# EAGLE design MainTestBRD (EAGLE 7.1.0)
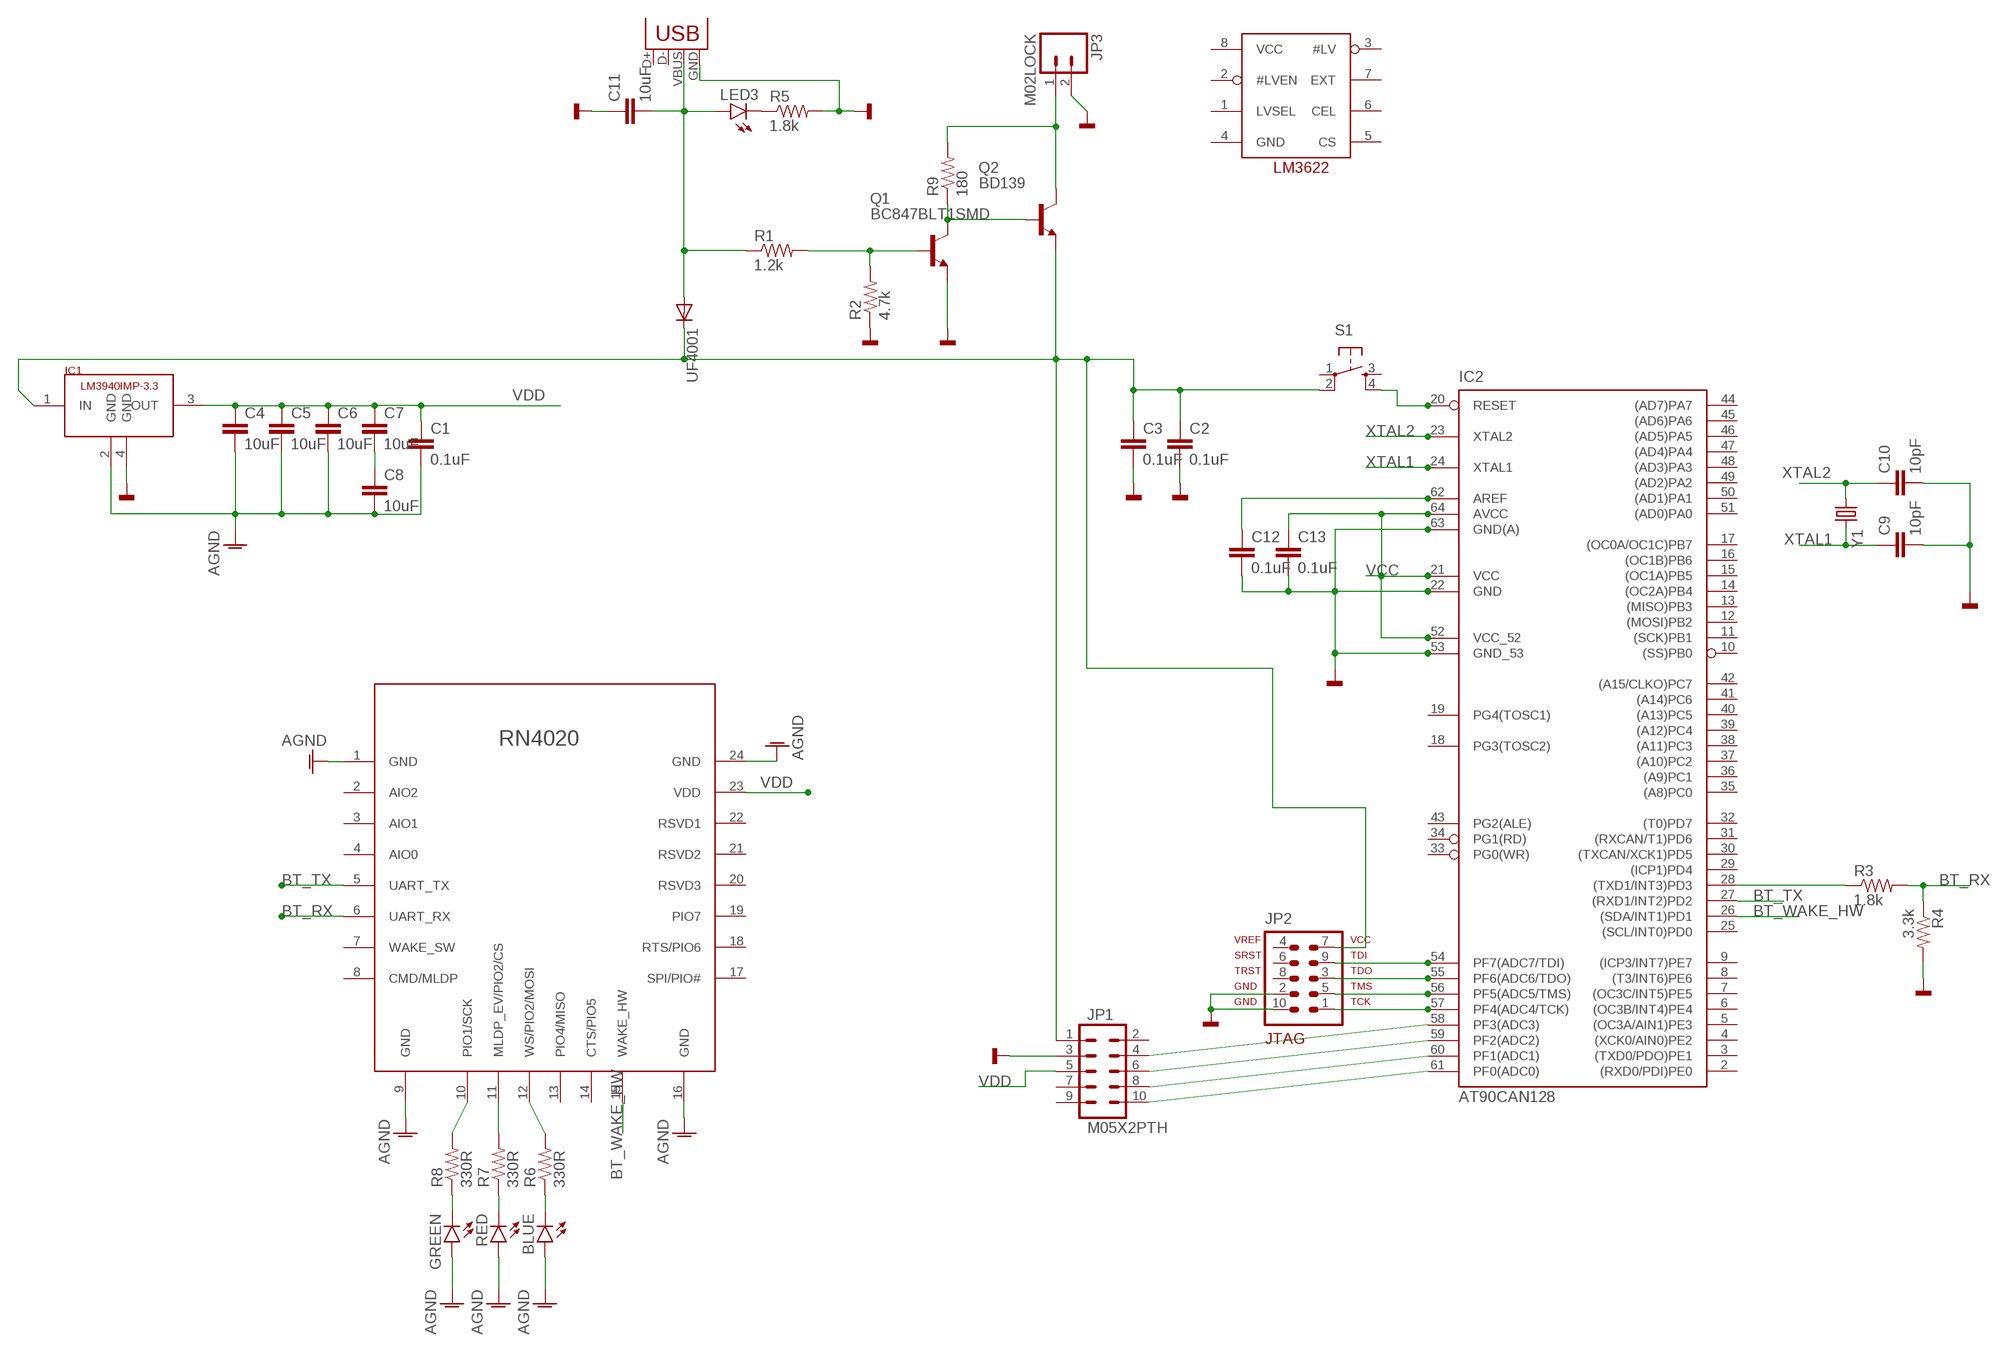
[diagram p0: schematic, sheet 1]

## Parts
BLUE  LED1206  [LED-1206]
C1  0.1uF  10UF-6.3V-20%(1206)  [1206]
C2  0.1uF  10UF-6.3V-20%(1206)  [1206]
C3  0.1uF  10UF-6.3V-20%(1206)  [1206]
C4  10uF  10UF-6.3V-20%(1206)  [1206]
C5  10uF  10UF-6.3V-20%(1206)  [1206]
C6  10uF  10UF-6.3V-20%(1206)  [1206]
C7  10uF  10UF-6.3V-20%(1206)  [1206]
C8  10uF  10UF-6.3V-20%(1206)  [1206]
C9  10pF  10UF-6.3V-20%(1206)  [1206]
C10  10pF  10UF-6.3V-20%(1206)  [1206]
C11  10uF  10UF-6.3V-20%(1206)  [1206]
C12  0.1uF  10UF-6.3V-20%(1206)  [1206]
C13  0.1uF  10UF-6.3V-20%(1206)  [1206]
GREEN  LED1206  [LED-1206]
IC1  LM3940IMP-3.3  [SOT223]
IC2  AT90CAN128  [TQFP64]
JP1  M05X2PTH  [AVR_ICSP]
JP2  AVR-JTAG-10  [AVR-JTAG-10]
JP3  M02LOCK  [1X02_LOCK]
JP4  USB-B  USBPTH  [USB-B-PTH]
LED3  LED1206  [LED-1206]
Q1  BC847BLT1SMD  [SOT23]
Q2  BD139  [TO126]
R1  1.2k  1.8KOHM1/10W1%(0603)  [0603-RES]
R2  4.7k  1.8KOHM1/10W1%(0603)  [0603-RES]
R3  1.8k  3.3KOHM1/10W1%(0603)  [0603-RES]
R4  3.3k  3.3KOHM1/10W1%(0603)  [0603-RES]
R5  1.8k  1.8KOHM1/10W1%(0603)  [0603-RES]
R6  330R  1.8KOHM1/10W1%(0603)  [0603-RES]
R7  330R  1.8KOHM1/10W1%(0603)  [0603-RES]
R8  330R  1.8KOHM1/10W1%(0603)  [0603-RES]
R9  180  1.8KOHM1/10W1%(0603)  [0603-RES]
RED  LED1206  [LED-1206]
S1  TAC_SWITCHPTH  [TACTILE-PTH]
U$1  LM3622  [SO08]
U$2  RN4020  [RN4020]
UF4001  DIODE-DO41-7.6  [DO41-7.6]
Y1  CRYSTALHC49UV  [HC49U-V]

## Nets
AGND: BLUE.A C1.2 C4.2 C5.2 C6.2 C8.2 GREEN.A IC1.2(GND) RED.A U$2.1(GND) U$2.9(GND) U$2.16(GND) U$2.24(GND)
BT_RX: R3.2 R4.1 U$2.6(UART_RX)
BT_TX: IC2.27((RXD1/INT2)PD2) U$2.5(UART_TX)
BT_WAKE_HW: IC2.26((SDA/INT1)PD1) U$2.15(WAKE_HW)
GND: C2.2 C3.2 C9.2 C10.2 C11.1 C12.2 C13.2 IC1.4(GND) IC2.22(GND) IC2.53(GND_53) IC2.63(GND(A)) JP1.3 JP2.2 JP2.10 JP3.2 JP4.GND Q1.2(E) R2.1 R4.2 R5.2
N$1: R6.2 U$2.12(WS/PIO2/MOSI)
N$2: R8.2 U$2.10(PIO1/SCK)
N$3: IC2.28((TXD1/INT3)PD3) R3.1
N$4: BLUE.C R6.1
N$5: R7.2 U$2.11(MLDP_EV/PIO2/CS)
N$6: IC2.57(PF4(ADC4/TCK)) JP2.1
N$7: R7.1 RED.C
N$8: C7.2 C8.1
N$9: IC2.56(PF5(ADC5/TMS)) JP2.5
N$10: GREEN.C R8.1
N$11: IC2.55(PF6(ADC6/TDO)) JP2.3
N$12: IC2.54(PF7(ADC7/TDI)) JP2.9
N$13: IC2.20(RESET) S1.4
N$14: Q1.1(B) R1.2 R2.2
N$15: C12.1 IC2.62(AREF)
N$16: IC2.61(PF0(ADC0)) JP1.10
N$17: C11.2 JP4.VBUS LED3.A R1.1 UF4001.A
N$18: Q1.3(C) Q2.3(B) R9.1
N$19: IC2.60(PF1(ADC1)) JP1.8
N$20: LED3.C R5.1
N$21: IC2.59(PF2(ADC2)) JP1.6
N$22: IC2.58(PF3(ADC3)) JP1.4
N$30: JP3.1 Q2.2(C) R9.2
N$31: Q2.1(E)
VCC: C2.1 C3.1 C13.1 IC1.1(IN) IC2.21(VCC) IC2.52(VCC_52) IC2.64(AVCC) JP1.1 JP2.7 S1.2 UF4001.C
VDD: C1.1 C4.1 C5.1 C6.1 C7.1 IC1.3(OUT) JP1.5 U$2.23(VDD)
XTAL1: C9.1 IC2.24(XTAL1) Y1.2
XTAL2: C10.1 IC2.23(XTAL2) Y1.1
Unconnected: IC2.2((RXD0/PDI)PE0) IC2.3((TXD0/PDO)PE1) IC2.4((XCK0/AIN0)PE2) IC2.5((OC3A/AIN1)PE3) IC2.6((OC3B/INT4)PE4) IC2.7((OC3C/INT5)PE5) IC2.8((T3/INT6)PE6) IC2.9((ICP3/INT7)PE7) IC2.10((SS)PB0) IC2.11((SCK)PB1) IC2.12((MOSI)PB2) IC2.13((MISO)PB3) IC2.14((OC2A)PB4) IC2.15((OC1A)PB5) IC2.16((OC1B)PB6) IC2.17((OC0A/OC1C)PB7) IC2.18(PG3(TOSC2)) IC2.19(PG4(TOSC1)) IC2.25((SCL/INT0)PD0) IC2.29((ICP1)PD4) IC2.30((TXCAN/XCK1)PD5) IC2.31((RXCAN/T1)PD6) IC2.32((T0)PD7) IC2.33(PG0(WR)) IC2.34(PG1(RD)) IC2.35((A8)PC0) IC2.36((A9)PC1) IC2.37((A10)PC2) IC2.38((A11)PC3) IC2.39((A12)PC4) IC2.40((A13)PC5) IC2.41((A14)PC6) IC2.42((A15/CLKO)PC7) IC2.43(PG2(ALE)) IC2.44((AD7)PA7) IC2.45((AD6)PA6) IC2.46((AD5)PA5) IC2.47((AD4)PA4) IC2.48((AD3)PA3) IC2.49((AD2)PA2) IC2.50((AD1)PA1) IC2.51((AD0)PA0) JP1.2 JP1.7 JP1.9 JP2.4 JP2.6 JP2.8 JP4.D+ JP4.D- S1.1 S1.3 U$1.1(LVSEL) U$1.2(#LVEN) U$1.3(#LV) U$1.4(GND) U$1.5(CS) U$1.6(CEL) U$1.7(EXT) U$1.8(VCC) U$2.2(AIO2) U$2.3(AIO1) U$2.4(AIO0) U$2.7(WAKE_SW) U$2.8(CMD/MLDP) U$2.13(PIO4/MISO) U$2.14(CTS/PIO5) U$2.17(SPI/PIO#) U$2.18(RTS/PIO6) U$2.19(PIO7) U$2.20(RSVD3) U$2.21(RSVD2) U$2.22(RSVD1)

## Library data of the parts
BLUE GREEN LED3 RED = SparkFun-LED:LED: LEDs Standard schematic elements and footprints for 5mm, 3mm, 1206, and 0603 sized LEDs. 5mm - Spark Fun Electronics SKU : COM-00529 (and others)
C1-C3 C9 C10 C12 C13 = SparkFun-Capacitors:10UF-6.3V-20%(1206): CAP-10057 Ceramic; PROD_ID: CAP-10057; VALUE: 10uF
C4-C8 C11 = SparkFun-Capacitors:10UF-6.3V-20%(1206): CAP-10057 Ceramic; PROD_ID: CAP-10057
IC1 = mylib:LM3940IMP-3.3: 1A Low Dropout Regulator for 5V to 3.3V conversion
IC2 = at90can128:AT90CAN128
JP1 = SparkFun-Connectors:M05X2: Header 5x2 Standard 10-pin dual row 0.1" header. Commonly used with AVR-ISP. Use with Spark Fun Electronics SKU: PRT-00778
JP2 = atmel:AVR-JTAG-10: AVR JTAG Debug/Programming Header
JP3 = SparkFun-Connectors:M02: Standard 2-pin 0.1" header. Use with - straight break away headers ( PRT-00116) - right angle break away headers (PRT-00553) - swiss pins (PRT-00743) - machine pins (PRT-00117) - female headers (PRT-00115) Molex polarized connector foot print use with: PRT-08233 with associated crimp pins and housings. 2.54_SCREWTERM for use with PRT-10571. 3.5mm Screw Terminal footprints for PRT-08084 5mm Screw Terminal footprints for use with PRT-08432
JP4 = SparkFun-Connectors:USB: USB Connectors USB-B-PTH is fully proven SKU : PRT-00139/CONN-08278 USB-miniB is fully proven SKU : PRT-00587 USB-A-PCB is untested. USB-A-H is throughly reviewed, but untested. Spark Fun Electronics SKU : PRT-00437 USB-B-SMT is throughly reviewed, but untested. Needs silkscreen touching up. USB-A-S has not been used/tested USB-MB-H has not been used/tested USB-MICROB has been used. CONN-09505; PROD_ID: CONN-08278
Q1 = transistor-npn:BC847*: NPN Transistor
Q2 = transistor-npn:BD139*: NPN Transistor
R1 R2 R6-R9 = SparkFun-Resistors:1.8KOHM1/10W1%(0603): RES-09119; PROD_ID: RES-09119; VALUE: 1.8k
R3 R4 = SparkFun-Resistors:3.3KOHM1/10W1%(0603): RES-07851; PROD_ID: RES-07851
R5 = SparkFun-Resistors:1.8KOHM1/10W1%(0603): RES-09119; PROD_ID: RES-09119
S1 = SparkFun-Electromechanical:TAC_SWITCH: Momentary Switch Button commonly used for reset or general input. Spark Fun Electronics SKU : COM-00097 SMT- SWCH-08247
U$1 = adafruit:LM3622: National LM3622 li-ion charger http://www.ladyada.net/library/eagle
U$2 = microchip:RN4020
UF4001 = diode:DIODE-: DIODE
Y1 = SparkFun-FreqCtrl:CRYSTAL: Various standard crystals. Proven footprints. Spark Fun Electronics SKU : COM-00534

## Board
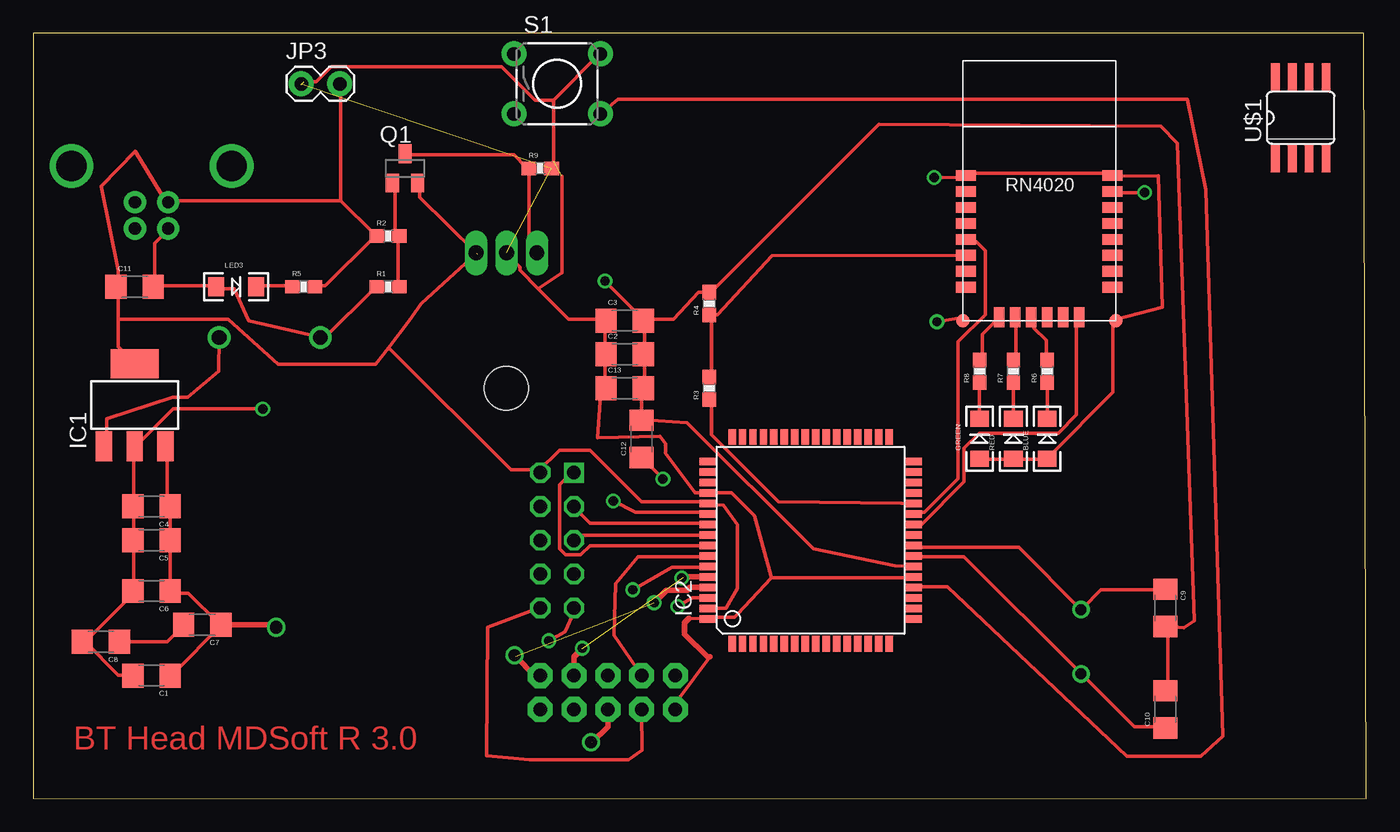
[diagram p1: board, top side]
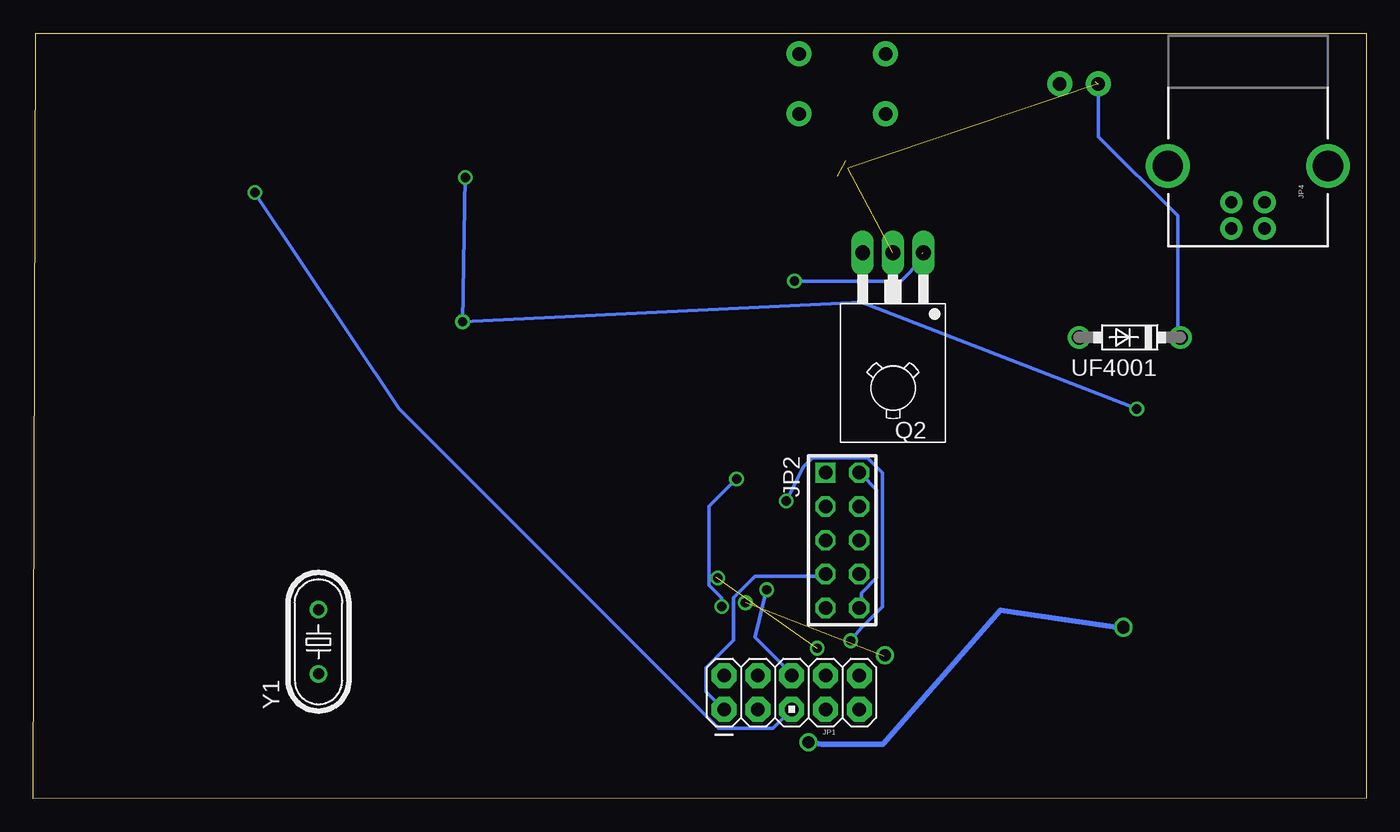
[diagram p2: board, bottom side, seen from below]

Size 100.18 x 57.5 mm. Coordinates in mm from the lower left corner, seen from the top.
Outline: 0,0.01 100.18,0 100,57.5 0,57.5 0,0.01
Copper layers (1*16): Top 0.035mm / dielectric 1.5mm / Bottom 0.035mm
Design rules "default *": minimum track width 10mil, minimum drill 0.7mm, track to track 8mil, track to pad 8mil, pad to pad 8mil, via to via 8mil, smd to smd 8mil, copper to edge 40mil, drill to drill 8mil, minimum pad ring 10mil, minimum via ring 8mil, stop-mask expansion 4mil, vias tented up to drill 0mil, thermal gap 10mil

### Footprints (pad centres in the part's own frame; a part is rotated, then mirrored left to right if it is on the bottom)
LED-1206 = smd 1.2 x 1.4: A -1.5,0; C 1.5,0
1206 = smd 1.6 x 1.8: 1 -1.4,0; 2 1.4,0
SOT223 = smd 1.219 x 2.235: 1 1.499,0.711; 2 3.81,0.711; 3 6.121,0.711 | smd 3.6 x 2.2: 4 3.81,6.909
TQFP64 = smd 1.194 x 0.559: 1 -7.76,5.905; 2 -7.76,5.118; 3 -7.76,4.331; 4 -7.76,3.543; 5 -7.76,2.756; 6 -7.76,1.968; 7 -7.76,1.181; 8 -7.76,0.394; 9 -7.76,-0.394; 10 -7.76,-1.181; 11 -7.76,-1.968; 12 -7.76,-2.756; 13 -7.76,-3.543; 14 -7.76,-4.331; 15 -7.76,-5.118; 16 -7.76,-5.905; 33 7.76,-5.905; 34 7.76,-5.118; 35 7.76,-4.331; 36 7.76,-3.543; 37 7.76,-2.756; 38 7.76,-1.968; 39 7.76,-1.181; 40 7.76,-0.394; 41 7.76,0.394; 42 7.76,1.181; 43 7.76,1.968; 44 7.76,2.756; 45 7.76,3.543; 46 7.76,4.331; 47 7.76,5.118; 48 7.76,5.905 | smd 0.559 x 1.194: 17 -5.905,-7.76; 18 -5.118,-7.76; 19 -4.331,-7.76; 20 -3.543,-7.76; 21 -2.756,-7.76; 22 -1.968,-7.76; 23 -1.181,-7.76; 24 -0.394,-7.76; 25 0.394,-7.76; 26 1.181,-7.76; 27 1.968,-7.76; 28 2.756,-7.76; 29 3.543,-7.76; 30 4.331,-7.76; 31 5.118,-7.76; 32 5.905,-7.76; 49 5.905,7.76; 50 5.118,7.76; 51 4.331,7.76; 52 3.543,7.76; 53 2.756,7.76; 54 1.968,7.76; 55 1.181,7.76; 56 0.394,7.76; 57 -0.394,7.76; 58 -1.181,7.76; 59 -1.968,7.76; 60 -2.756,7.76; 61 -3.543,7.76; 62 -4.331,7.76; 63 -5.118,7.76; 64 -5.905,7.76
AVR_ICSP = drill 1.016 pad 1.88 octagon: 1 -1.27,5.08; 2 1.27,5.08; 3 -1.27,2.54; 4 1.27,2.54; 5 -1.27,0; 6 1.27,0; 7 -1.27,-2.54; 8 1.27,-2.54; 9 -1.27,-5.08; 10 1.27,-5.08
AVR-JTAG-10 = drill 1.016 square: 1 -5.08,-1.27 | drill 1.016 octagon: 2 -5.08,1.27; 3 -2.54,-1.27; 4 -2.54,1.27; 5 0,-1.27; 6 0,1.27; 7 2.54,-1.27; 8 2.54,1.27; 9 5.08,-1.27; 10 5.08,1.27
1X02_LOCK = drill 1.016 pad 1.88: 1 -0.178,0; 2 2.718,0
USB-B-PTH = drill 0.914 pad 1.676: D+ 0,1.25; D- 1.981,1.25; GND 0,-1.25; VBUS 1.981,-1.25 | drill 2.286: S1 -2.718,-6.02; S2 -2.718,6.02
SOT23 = smd 1 x 1.4: 1 -0.95,-1.1; 2 0.95,-1.1; 3 0,1.1
TO126 = drill 1.118 long: 1 -2.286,-5.08; 2 0,-5.08; 3 2.286,-5.08 | hole 3.302: 0,5.08
0603-RES = smd 1.1 x 1: 1 -0.85,0; 2 0.85,0
TACTILE-PTH = drill 1.016 pad 1.88: 1 -3.251,2.261; 2 3.251,2.261; 3 -3.251,-2.261; 4 3.251,-2.261
SO08 = smd 0.66 x 2.032: 1 -1.905,-3.073; 2 -0.635,-3.073; 3 0.635,-3.073; 4 1.905,-3.073; 5 1.905,3.073; 6 0.635,3.073; 7 -0.635,3.073; 8 -1.905,3.073
RN4020 = smd 1.5 x 0.8: 1 0.25,10.9; 2 0.25,9.7; 3 0.25,8.5; 4 0.25,7.3; 5 0.25,6.1; 6 0.25,4.9; 7 0.25,3.7; 8 0.25,2.5; 17 11.25,2.5; 18 11.25,3.7; 19 11.25,4.9; 20 11.25,6.1; 21 11.25,7.3; 22 11.25,8.5; 23 11.25,9.7; 24 11.25,10.9 | smd 1 x 1: 9 0,0; 16 11.5,0 | smd 0.8 x 1.5: 10 2.75,0.25; 11 3.95,0.25; 12 5.15,0.25; 13 6.35,0.25; 14 7.55,0.25; 15 8.75,0.25
DO41-7.6 = drill 1.1 pad 1.7: A 3.81,0; C -3.81,0
HC49U-V = drill 0.813: 1 -2.413,0; 2 2.413,0

### Placement (x,y rotation side)
BLUE  76.2,27.03 90 top
C1  8.89,9.25 180 top
C2  44.45,33.38 0 top
C3  44.45,35.92 0 top
C4  8.89,21.95 180 top
C5  8.89,19.41 180 top
C6  8.89,15.6 180 top
C7  12.7,13.06 180 top
C8  5.08,11.79 180 top
C9  85.09,14.33 270 top
C10  85.09,6.71 90 top
C11  7.62,38.46 0 top
C12  45.72,27.03 90 top
C13  44.45,30.84 0 top
GREEN  71.12,27.03 90 top
IC1  3.81,25.76 0 top
IC2  58.42,19.41 90 top
JP1  43.18,7.98 90 bottom
JP2  39.37,19.41 270 bottom
JP3  20.32,53.7 0 top
JP4  8.89,44.81 270 bottom
LED3  15.24,38.46 0 top
Q1  27.94,47.35 0 top
Q2  35.56,35.92 180 bottom
R1  26.67,38.46 0 top
R2  26.67,42.27 0 top
R3  50.8,30.84 90 top
R4  50.8,37.19 90 top
R5  20.32,38.46 0 top
R6  76.2,32.11 90 top
R7  73.66,32.11 90 top
R8  71.12,32.11 90 top
R9  38.1,47.35 0 top
RED  73.66,27.03 90 top
S1  39.37,53.7 0 top
U$1  95.25,51.16 0 top
U$2  69.85,35.92 0 top
UF4001  17.78,34.65 180 bottom
Y1  78.74,11.79 90 bottom

### Tracks (layer width: path | path; a pad name or v marks a point on that pad's centre or on a via)
AGND  (via drill 0.7)
  Top 0.254: GREEN.A 71.32,25.5 73.61,25.5 RED.A 73.84,25.5 76.12,25.5 BLUE.A 76.35,25.73 81.15,30.53 81.15,35.79 U$2.16 81.38,36.02 84.84,36.93 84.56,46.79 81.61,46.76 81.15,46.76 U$2.24 80.92,46.99 70.18,46.99 U$2.1 69.95,46.65 69.49,46.65 v67.71,46.67 | 3.89,11.79 6.4,9.27 7.32,9.27 C1.2 | 3.89,11.79 7.54,15.44 C6.2 7.54,15.67 7.54,19.33 C5.2 7.54,19.56 7.54,21.84 C4.2 7.54,21.96 7.54,26.3 IC1.2 7.77,26.53 10.52,29.28 v17.25,29.28 | 3.89,11.79 C8.2 | v67.91,35.83 69.72,36.13 U$2.9
  Bottom 0.254: v67.71,46.67 v67.91,35.83 37.95,37.28 v17.25,29.28
BT_RX
  Top 0.254: R3.2 50.98,31.9 50.98,36.25 R4.1 51.44,36.35 55.52,40.79 69.88,40.82 U$2.6
BT_TX
  Top 0.254: IC2.27 66.29,21.5 66.98,21.5 69.49,24.02 69.49,34.31 71.55,36.36 71.55,41.16 70.87,41.85 70.18,41.85 U$2.5
BT_WAKE_HW
  Top 0.254: IC2.26 66.29,20.59 66.75,20.59 69.95,23.79 69.95,26.3 71.09,27.45 77.04,27.45 78.41,28.82 78.41,36.13 U$2.15
GND  (via drill 0.7)  (1 unrouted)
  Top 0.254: R5.2 21.26,38.53 21.95,38.53 25.6,42.19 R2.1 25.6,42.42 23.09,44.93 | 23.09,44.93 23.09,53.62 JP3.2 | 33.15,41.05 33.3,40.97 | 33.3,40.97 29.03,45.16 29.03,46.08 Q1.2 | 6.4,36.02 6.4,33.96 7.54,32.82 IC1.4 | 6.4,36.02 6.4,38.3 C11.1 6.4,38.53 6.4,39.67 5.11,46 7.64,48.64 10.06,44.7 JP4.GND 10.29,44.93 23.09,44.93 | 33.3,40.97 29.16,37.16 28.25,35.89 26.7,33.89 | 26.7,33.89 25.73,32.64 18.39,32.61 14.63,36.02 6.4,36.02 | C10.2 85.27,8.13 85.27,12.7 C9.2 85.27,12.93 86.49,12.85 87.27,13.36 85.98,49.25 84.76,50.5 63.55,50.65 50.98,38.07 R4.2 50.01,38.05 48.11,36.02 45.95,36.02 C3.2 | C3.2 45.95,35.79 45.95,33.5 C2.2 45.95,33.27 45.95,30.99 C13.2 45.72,30.65 C12.2 45.87,28.45 49.15,28.24 58.62,18.77 64.77,17.48 IC2.22 | IC2.63 50.75,14.3 52.05,14.3 52.93,15.8 52.93,20.57 51.87,22.05 50.75,22.07 IC2.53 50.52,22.3 45.72,22.3 41.83,26.19 39.55,26.19 37.95,24.59 JP2.2 37.95,24.7 35.89,24.7 26.75,33.85 26.7,33.89 | JP1.3 45.72,6.53 45.76,3.65 44.74,2.9 37.3,2.9 34.05,3.2 34.13,12.88 37.95,14.3 JP2.10 | v42.98,38.88 45.72,36.13 C3.2
  Bottom 0.254: JP2.10 37.95,14.53 37.95,15.44 36.8,16.59 36.8,23.22 37.95,24.36 JP2.2 | v42.98,38.88 34.98,38.88 33.38,40.48 33.38,40.93
N$1
  Top 0.254: R6.2 76.12,33.05 76.12,34.42 75.21,35.33 75.21,36.02 U$2.12
N$2
  Top 0.254: R8.2 71.32,33.05 71.32,34.87 72.47,36.02 U$2.10
N$3
  Top 0.254: R3.1 50.98,29.84 50.98,27.33 56.01,22.3 65.25,22.17 IC2.28
N$4
  Top 0.254: BLUE.C R6.1
N$5
  Top 0.254: R7.2 73.84,33.05 73.84,36.02 U$2.11
N$6
  Top 0.254: IC2.57 50.52,18.99 41.83,18.99 41.15,18.3 40.01,18.3 39.55,18.76 39.55,23.56 40.46,24.48 JP2.1
N$7
  Top 0.254: RED.C R7.1
N$8
  Top 0.254: C8.1 10.06,11.79 11.2,12.93 C7.2
N$9
  Top 0.254: IC2.56 50.52,19.79 40.92,19.79 40.69,19.56 JP2.5
N$10
  Top 0.254: R8.1 71.09,31.22 71.09,28.7 GREEN.C
N$11
  Top 0.254: IC2.55 50.52,20.7 41.83,20.7 40.69,21.84 JP2.3
N$12  (via drill 0.7)
  Top 0.254: v43.58,22.37 45.26,21.5 50.52,21.5 IC2.54 | v38.75,11.86 39.96,12.52 40.67,14.13 JP2.9
  Bottom 0.254: v43.58,22.37 42.29,24.93 41.6,25.62 37.49,25.62 36.35,24.48 36.35,14.42 37.95,12.82 v38.75,11.86
N$13
  Top 0.254: IC2.20 66.29,15.9 68.71,15.9 82.17,3.17 87.76,3.17 89.41,4.7 88.14,45.75 86.74,52.53 43.94,52.55 S1.4
N$14
  Top 0.254: Q1.1 27.2,46.08 27.2,42.65 27.43,42.42 R2.2 27.43,42.19 27.43,38.53 R1.2
N$15  (via drill 0.7)
  Top 0.254: v48.43,14.44 49.53,15.1 50.52,15.1 IC2.62 | v47.32,24.02 C12.1
  Bottom 0.254: v48.43,14.44 48.46,15.1 49.38,16.02 49.38,21.96 v47.32,24.02
N$16  (1 unrouted)
  Top 0.406: IC2.61 49.37,15.86 49.14,15.64 47.6,15.64 46.67,14.71 | JP1.10 37.69,9.25 36.23,10.71
N$17
  Top 0.254: 9.14,38.53 9.14,41.73 10.06,42.65 JP4.VBUS | 9.14,38.53 13.72,38.53 LED3.A 13.95,38.3 15.09,38.3 16.2,35.92 UF4001.A 21.95,34.65 25.6,38.3 R1.1 | 9.14,38.53 C11.2
N$18
  Top 0.254: Q2.3 37.72,41.05 37.26,41.5 37.26,47.22 R9.1 37.03,47.45 36.12,48.36 28.12,48.36 Q1.3
N$19  (1 unrouted)
  Top 0.406: IC2.60 48.86,16.65 | JP1.8 40.64,10.65 41.25,11.26
N$20
  Top 0.254: R5.1 19.43,38.53 16.92,38.53 LED3.C
N$21  (via drill 0.7)
  Top 0.254: v45.06,15.69 48.01,17.39 50.52,17.39 IC2.59
  Bottom 0.254: v45.06,15.69 45.95,12.13 43.2,9.39 JP1.6
N$22
  Top 0.254: IC2.58 50.52,18.19 45.46,18.19 43.74,16.14 43.63,12.29 45.72,9.27 JP1.4
N$23  (via drill 0.9)
  other vias: 41.92,4.22
N$24  (via drill 0.9)
  other vias: 18.27,12.93
N$25  (via drill 0.9)
  other vias: 36.17,10.77
N$26  (via drill 0.7)
  other vias: 46.66,14.72
N$28  (via drill 0.7)
  other vias: 41.27,11.3
N$29  (via drill 0.7)
  other vias: 48.73,16.58
N$30  (2 unrouted)
VCC  (2 unrouted)
  Top 0.254: IC1.1 5.49,26.64 5.51,28.52 10.46,30.15 11.61,30.15 13.95,32.11 UF4001.C | 55.47,16.59 52.93,13.84 52.7,13.61 50.75,13.61 IC2.64 49.27,13.54 | 55.47,16.59 54.2,21.26 52.48,22.99 50.75,22.99 IC2.52 50.52,22.99 49.73,22.99 47.52,25.93 47.52,26.64 47.12,27.2 42.39,27.13 42.65,30.38 C13.1 42.98,30.99 42.98,33.27 C2.1 42.98,33.5 42.98,35.79 C3.1 42.98,36.02 40.23,36.02 37.95,38.3 | 55.47,16.59 66.06,16.59 IC2.21 | 50.87,10.65 48.46,7.44 48.46,6.76 JP1.1 | 35.66,40.82 36.58,39.9 36.58,39.67 37.95,38.3 | 39.09,52.48 39.09,47.9 | 39.09,52.48 42.52,55.91 S1.2 | 20.34,53.85 21.26,53.85 22.4,54.99 35.2,54.99 37.72,52.48 39.09,52.48 | 37.95,38.3 39.73,39.5 39.75,46.74
  Top 0.406: 50.87,10.65 50.66,10.65 48.96,12.35 48.96,13.23 49.27,13.54
  Bottom 0.254: 20.12,53.62 20.12,49.73 14.17,43.79 14.17,34.76 UF4001.C 14.17,34.65 | JP2.7 40.69,16.7 45.95,16.7 47.55,15.1 47.55,11.9 49.61,9.85 49.61,8.02 48.46,6.87 JP1.1
VDD  (via drill 0.7, 0.9)  (1 unrouted)
  Top 0.254: IC1.3 10.06,26.42 10.06,22.3 10.29,22.07 C4.1 10.29,21.84 10.29,19.56 C5.1 10.29,19.33 10.29,15.67 C6.1 10.52,15.44 11.66,15.44 13.95,13.16 C7.1 14.17,13.05 10.52,9.39 C1.1 | v83.53,45.52 80.47,45.51 80.92,45.51 U$2.23
  Top 0.406: JP1.5 43.18,5.4 42.01,4.23 | C7.1 18.03,13.06 v18.27,12.82
  Bottom 0.254: v83.53,45.52 72.69,29.28 48.69,5.27 44.58,5.27 43.2,6.64 JP1.5
  Bottom 0.406: v18.27,12.82 27.51,14.14 36.32,4.08 40.91,4.08 42.01,4.23
XTAL1
  Top 0.254: IC2.24 66.29,18.87 74.07,18.87 Y1.2 78.87,14.3 80.24,15.67 85.04,15.67 C9.1
XTAL2
  Top 0.254: C10.1 85.04,5.38 82.75,5.38 78.87,9.27 Y1.1 78.64,9.5 69.95,18.19 66.29,18.19 IC2.23

### Text on the board
Top: BT Head MDSoft R 3.0